# EAGLE design WS2812-Stick_v10 (EAGLE 7.5.0)
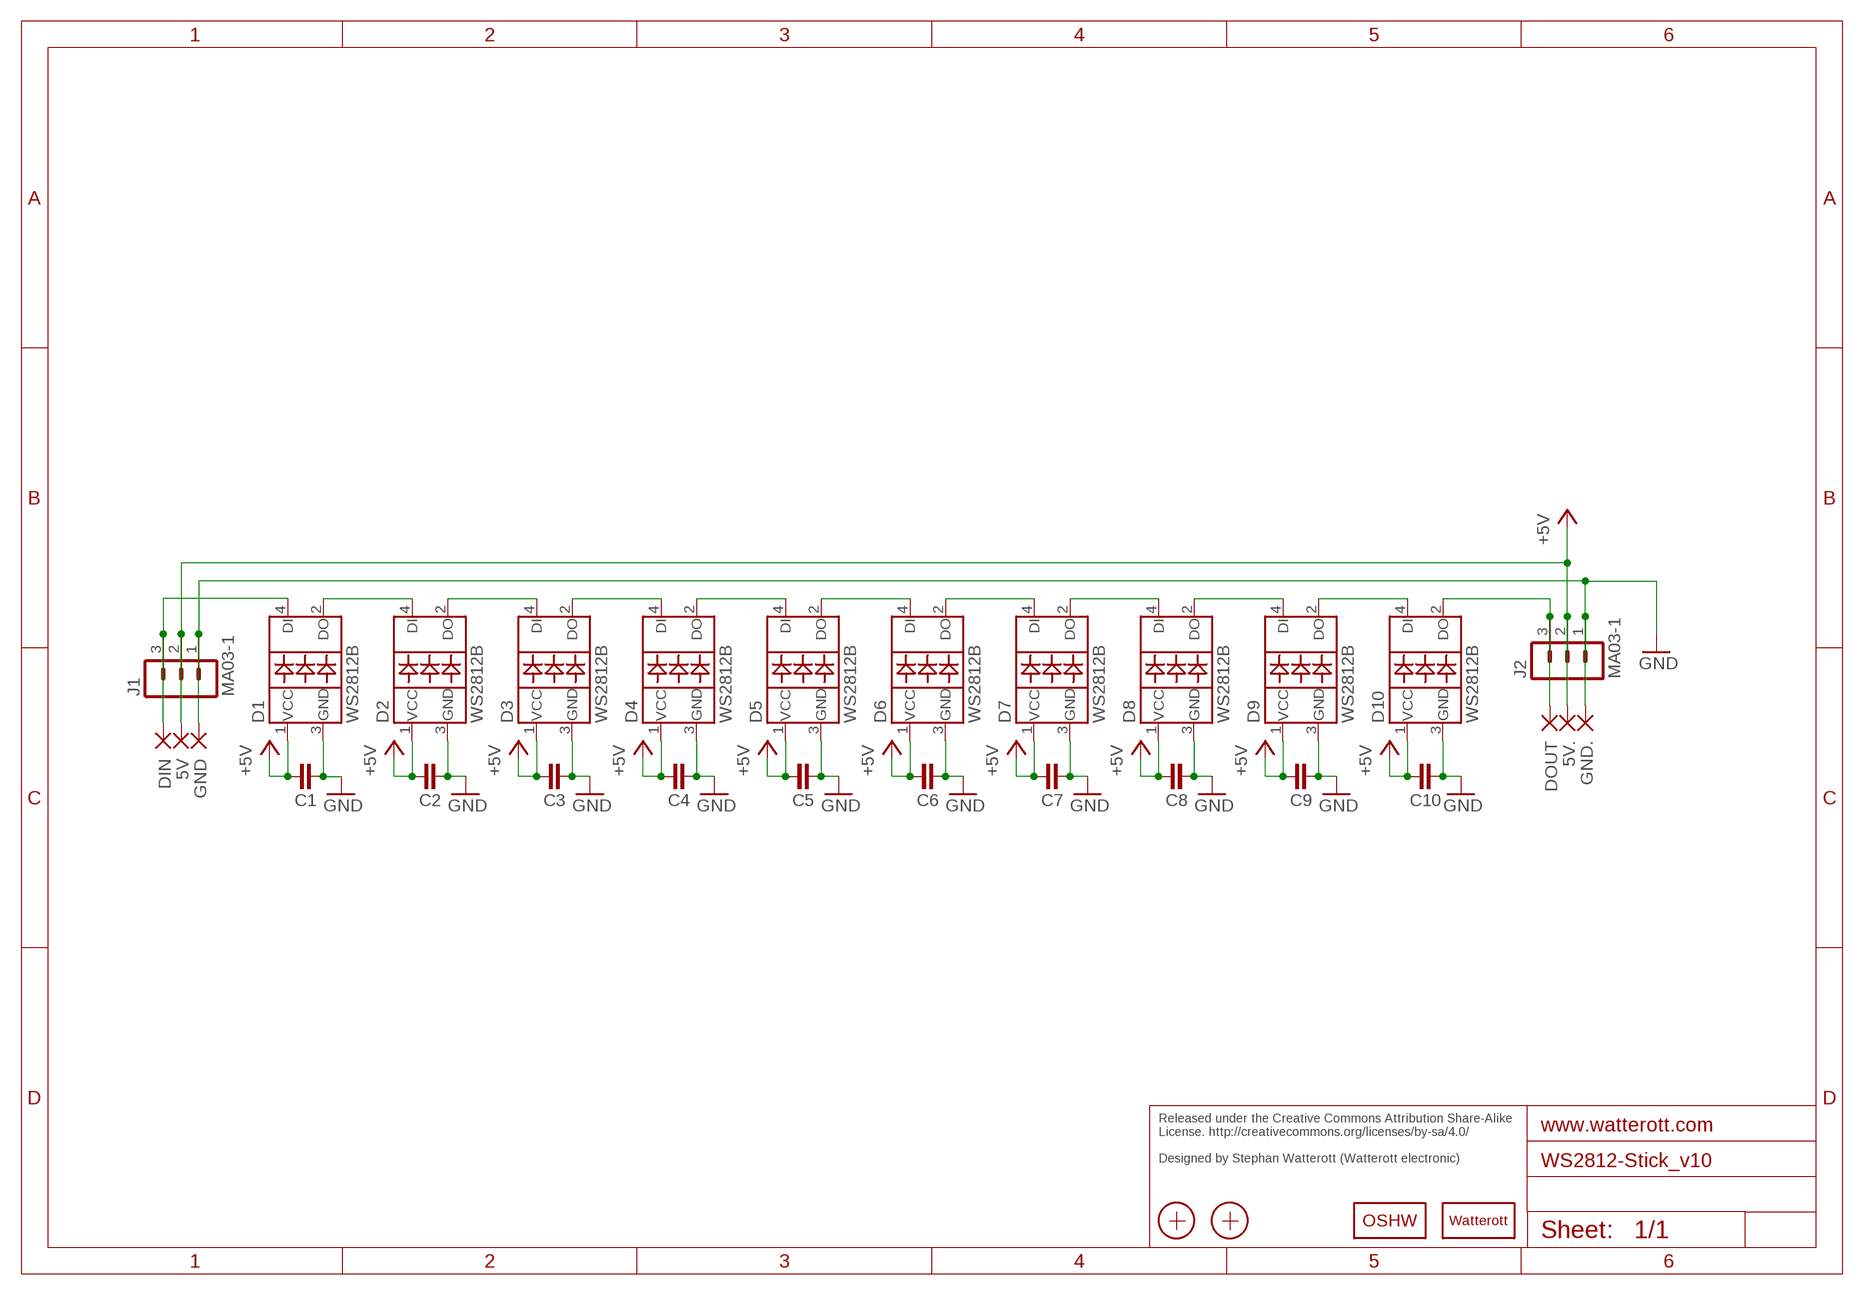
[diagram p0: schematic, sheet 1]

## Parts
5V  SMD2  [SMD1,27-2,54]
5V.  SMD2  [SMD1,27-2,54]
C1  CAPACITOR-0402  [C0402]
C2  CAPACITOR-0402  [C0402]
C3  CAPACITOR-0402  [C0402]
C4  CAPACITOR-0402  [C0402]
C5  CAPACITOR-0402  [C0402]
C6  CAPACITOR-0402  [C0402]
C7  CAPACITOR-0402  [C0402]
C8  CAPACITOR-0402  [C0402]
C9  CAPACITOR-0402  [C0402]
C10  CAPACITOR-0402  [C0402]
D1  WS2812B  [WS2812B]
D2  WS2812B  [WS2812B]
D3  WS2812B  [WS2812B]
D4  WS2812B  [WS2812B]
D5  WS2812B  [WS2812B]
D6  WS2812B  [WS2812B]
D7  WS2812B  [WS2812B]
D8  WS2812B  [WS2812B]
D9  WS2812B  [WS2812B]
D10  WS2812B  [WS2812B]
DIN  SMD2  [SMD1,27-2,54]
DOUT  SMD2  [SMD1,27-2,54]
GND  SMD2  [SMD1,27-2,54]
GND.  SMD2  [SMD1,27-2,54]
J1  MA03-1  [MA03-1]
J2  MA03-1  [MA03-1]
LOGO1  OSHW_LOGOX0070  [OSHW_6X70]
LOGO2  LOGO-PLACE  [LOGO_TPLACE]
X1  PASSER-07  [PASSER_07MM]
X2  PASSER-07  [PASSER_07MM]

## Nets
+5V: 5V.1(P) 5V..1(P) C1.2 C2.2 C3.2 C4.2 C5.2 C6.2 C7.2 C8.2 C9.2 C10.2 D1.1(VCC) D2.1(VCC) D3.1(VCC) D4.1(VCC) D5.1(VCC) D6.1(VCC) D7.1(VCC) D8.1(VCC) D9.1(VCC) D10.1(VCC) J1.2 J2.2
GND: C1.1 C2.1 C3.1 C4.1 C5.1 C6.1 C7.1 C8.1 C9.1 C10.1 D1.3(GND) D2.3(GND) D3.3(GND) D4.3(GND) D5.3(GND) D6.3(GND) D7.3(GND) D8.3(GND) D9.3(GND) D10.3(GND) GND.1(P) GND..1(P) J1.1 J2.1
N$1: D1.4(DI) DIN.1(P) J1.3
N$24: D1.2(DO) D2.4(DI)
N$25: D2.2(DO) D3.4(DI)
N$26: D3.2(DO) D4.4(DI)
N$27: D4.2(DO) D5.4(DI)
N$28: D5.2(DO) D6.4(DI)
N$29: D6.2(DO) D7.4(DI)
N$30: D7.2(DO) D8.4(DI)
N$31: D8.2(DO) D9.4(DI)
N$32: D9.2(DO) D10.4(DI)
N$33: D10.2(DO) DOUT.1(P) J2.3

## Notes on the sheet
- Released under the Creative Commons Attribution Share-Alike 
  License. http://creativecommons.org/licenses/by-sa/4.0/
  
  Designed by Stephan Watterott (Watterott electronic)

## Library data of the parts
5V 5V. DIN DOUT GND GND. = wirepad:SMD2: SMD PAD
C1-C10 = we-rcl:CAPACITOR: Capacitors ...4.7uF @ 6.3V -> 0402 ...10uF @ 16V -> 0603 ...22uF @ 25V -> 0805
D1-D10 = we-opto:WS2812B: WS2812 Intelligent RGB LED
J1 J2 = we-con:MA03-1: Pin Header
LOGO1 = we-symbol:OSHW_LOGO: Open-Source-Hardware Logo
LOGO2 = we-symbol:LOGO: Watterott electronic Logo
X1 X2 = we-symbol:PASSER: Fiducial Markers

## Board
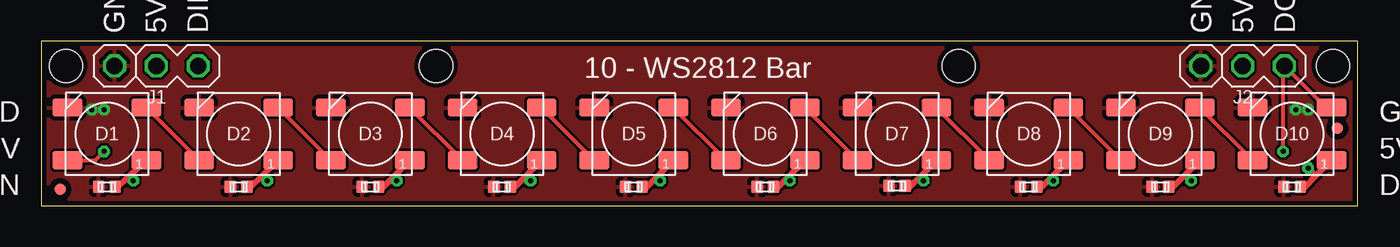
[diagram p1: board, top side]
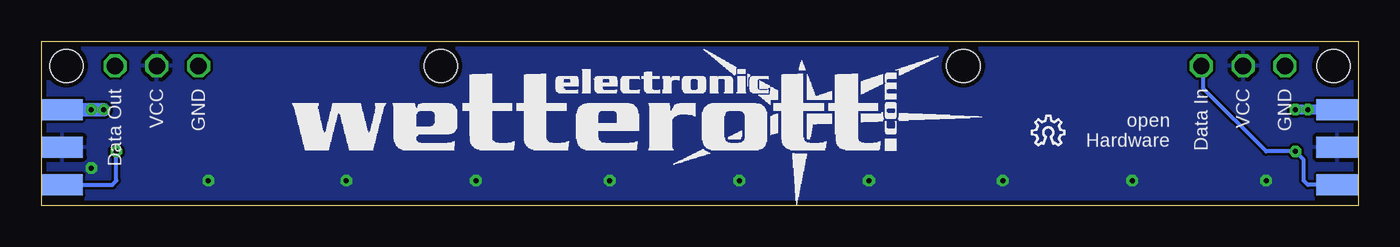
[diagram p2: board, bottom side, seen from below]

Size 80 x 10 mm. Coordinates in mm from the lower left corner, seen from the top.
Outline: 0,0 80,0 80,10 0,10 0,0
Copper layers (1*16): Top 0.035mm / dielectric 1.5mm / Bottom 0.035mm
Design rules "we-dru[1] *": minimum track width 0.15mm, minimum drill 0.3mm, track to track 0.15mm, track to pad 0.15mm, pad to pad 0.15mm, via to via 0.15mm, smd to smd 0.1mm, copper to edge 0.3mm, drill to drill 0.2mm, minimum pad ring 0.18mm, minimum via ring 0.2mm, stop-mask expansion 0.1mm, vias tented up to drill 0.5mm, thermal gap 0.25mm
Holes 2 mm at 78.5,8.5 1.5,8.5 24,8.5 55.74,8.5

### Footprints (pad centres in the part's own frame; a part is rotated, then mirrored left to right if it is on the bottom)
SMD1,27-2,54 = smd 1.27 x 2.54: 1 0,0
C0402 = smd 0.75 x 0.7: 1 0,0.5; 2 0,-0.5
WS2812B = smd 1.8 x 1.1: 1 -2.4,1.6; 2 -2.4,-1.6; 3 2.4,-1.6; 4 2.4,1.6
MA03-1 = drill 1 octagon: 1 0,2.54; 2 0,0; 3 0,-2.54
PASSER_07MM = smd 0.7 x 0.7: X 0,0

### Placement (x,y rotation side)
5V  1.29,3.56 270 bottom
5V.  78.76,3.56 270 bottom
C1  4,1.17 90 top
C2  12,1.17 90 top
C3  20,1.17 90 top
C4  28,1.17 90 top
C5  52,1.22 90 top
C6  60,1.17 90 top
C7  36,1.17 90 top
C8  44,1.17 90 top
C9  76,1.17 90 top
C10  68,1.17 90 top
D1  4,4.37 180 top
D2  12,4.37 180 top
D3  20,4.37 180 top
D4  28,4.37 180 top
D5  36,4.37 180 top
D6  44,4.37 180 top
D7  52,4.37 180 top
D8  60,4.37 180 top
D9  68,4.37 180 top
D10  76,4.37 180 top
DIN  1.29,1.27 270 bottom
DOUT  78.76,1.27 270 bottom
GND  1.29,5.84 270 bottom
GND.  78.76,5.84 270 bottom
J1  7,8.5 90 top
J2  73,8.5 90 top
LOGO1  19.83,3.68 0 bottom
LOGO2  65.04,-0.25 0 bottom
X1  1.16,1.02 0 top
X2  78.76,4.7 0 top

### Tracks (layer width: path | path; a pad name or v marks a point on that pad's centre or on a via)
+5V  (via drill 0.3)
  Top 0.406: C1.2 4.64,1.17 5.21,1.68 | 5.21,1.68 D1.1 | C2.2 12.72,1.17 13.43,1.84 | 13.43,1.84 D2.1 | C3.2 20.8,1.17 21.38,1.75 | 21.38,1.75 D3.1 | C4.2 28.8,1.17 29.45,1.81 | 29.45,1.81 D4.1 | C7.2 36.8,1.17 37.38,1.75 | 37.38,1.75 D5.1 | C5.2 52.85,1.22 53.38,1.75 | 53.38,1.75 D7.1 | C10.2 68.8,1.17 69.51,1.88 | 69.51,1.88 D9.1 | C9.2 76.8,1.17 77.45,1.81 | 77.45,1.81 D10.1 | C8.2 44.8,1.17 45.32,1.69 | 45.32,1.69 D6.1 | C6.2 60.8,1.17 61.32,1.69 | 61.32,1.69 D8.1 | v5.6,1.52 5.36,1.52 5.21,1.68 | v13.73,1.52 13.73,1.54 13.43,1.84 | v21.61,1.52 21.38,1.75 | v29.73,1.52 29.45,1.81 | v37.61,1.52 37.38,1.75 | v45.48,1.52 45.32,1.69 | v53.61,1.52 53.38,1.75 | v61.48,1.52 61.32,1.69 | v69.87,1.52 69.51,1.88 | v76.98,2.29 77.45,1.81
  pour Bottom: 0,0 80,0 80,10 0,10
GND  (via drill 0.3)
  Bottom 0.61: GND.1 v3.83,5.84
  Bottom 0.813: GND..1 v76.22,5.84
  other vias: 3.06,5.84 76.98,5.84
  pour Top: 0,0 80,0 80,10 0,10
N$1  (via drill 0.3)
  Top 0.254: D1.4 3.29,2.77 v3.83,3.3
  Bottom 0.254: J1.3 9.41,8.37 9.41,7.11 5.6,3.3 v3.83,3.3 3.32,2.79 3.32,1.52 3.06,1.27 DIN.1
N$24
  Top 0.254: D2.4 D1.2
N$25
  Top 0.254: D3.4 D2.2
N$26
  Top 0.254: D4.4 D3.2
N$27
  Top 0.254: D5.4 D4.2
N$28
  Top 0.254: D6.4 D5.2
N$29
  Top 0.254: D7.4 D6.2
N$30
  Top 0.254: D8.4 D7.2
N$31
  Top 0.254: D9.4 D8.2
N$32
  Top 0.254: D10.4 D9.2
N$33  (via drill 0.3)
  Top 0.254: D10.2 78.08,5.96 J2.3 75.45,8.41 v75.45,3.3
  Bottom 0.254: DOUT.1 75.71,1.27 75.45,1.52 v75.45,3.3

### Text on the board
tPlace: 10 - WS2812 Bar
bPlace: GND | VCC | Data In | GND | VCC | Data Out | open / Hardware
tNames: GND | 5V | DIN | GND | 5V | DOUT | GND | GND | 5V | 5V | DIN | DOUT
Reference: Silkscreen: 21 tPlace + 22 bPlace